# EasyEDA Pro project can-mcu.eprj, schematic mod-input-isolated
Board Name: mod-input-isolated; Create Date: 2026-08-19; Page Name: P1; Project Name: can-mcu; Schematic Name: mod-input-isolated; Update Date: 2026-08-19; Company: EasyEDA.com; Page Size: A4; Version: V1.0
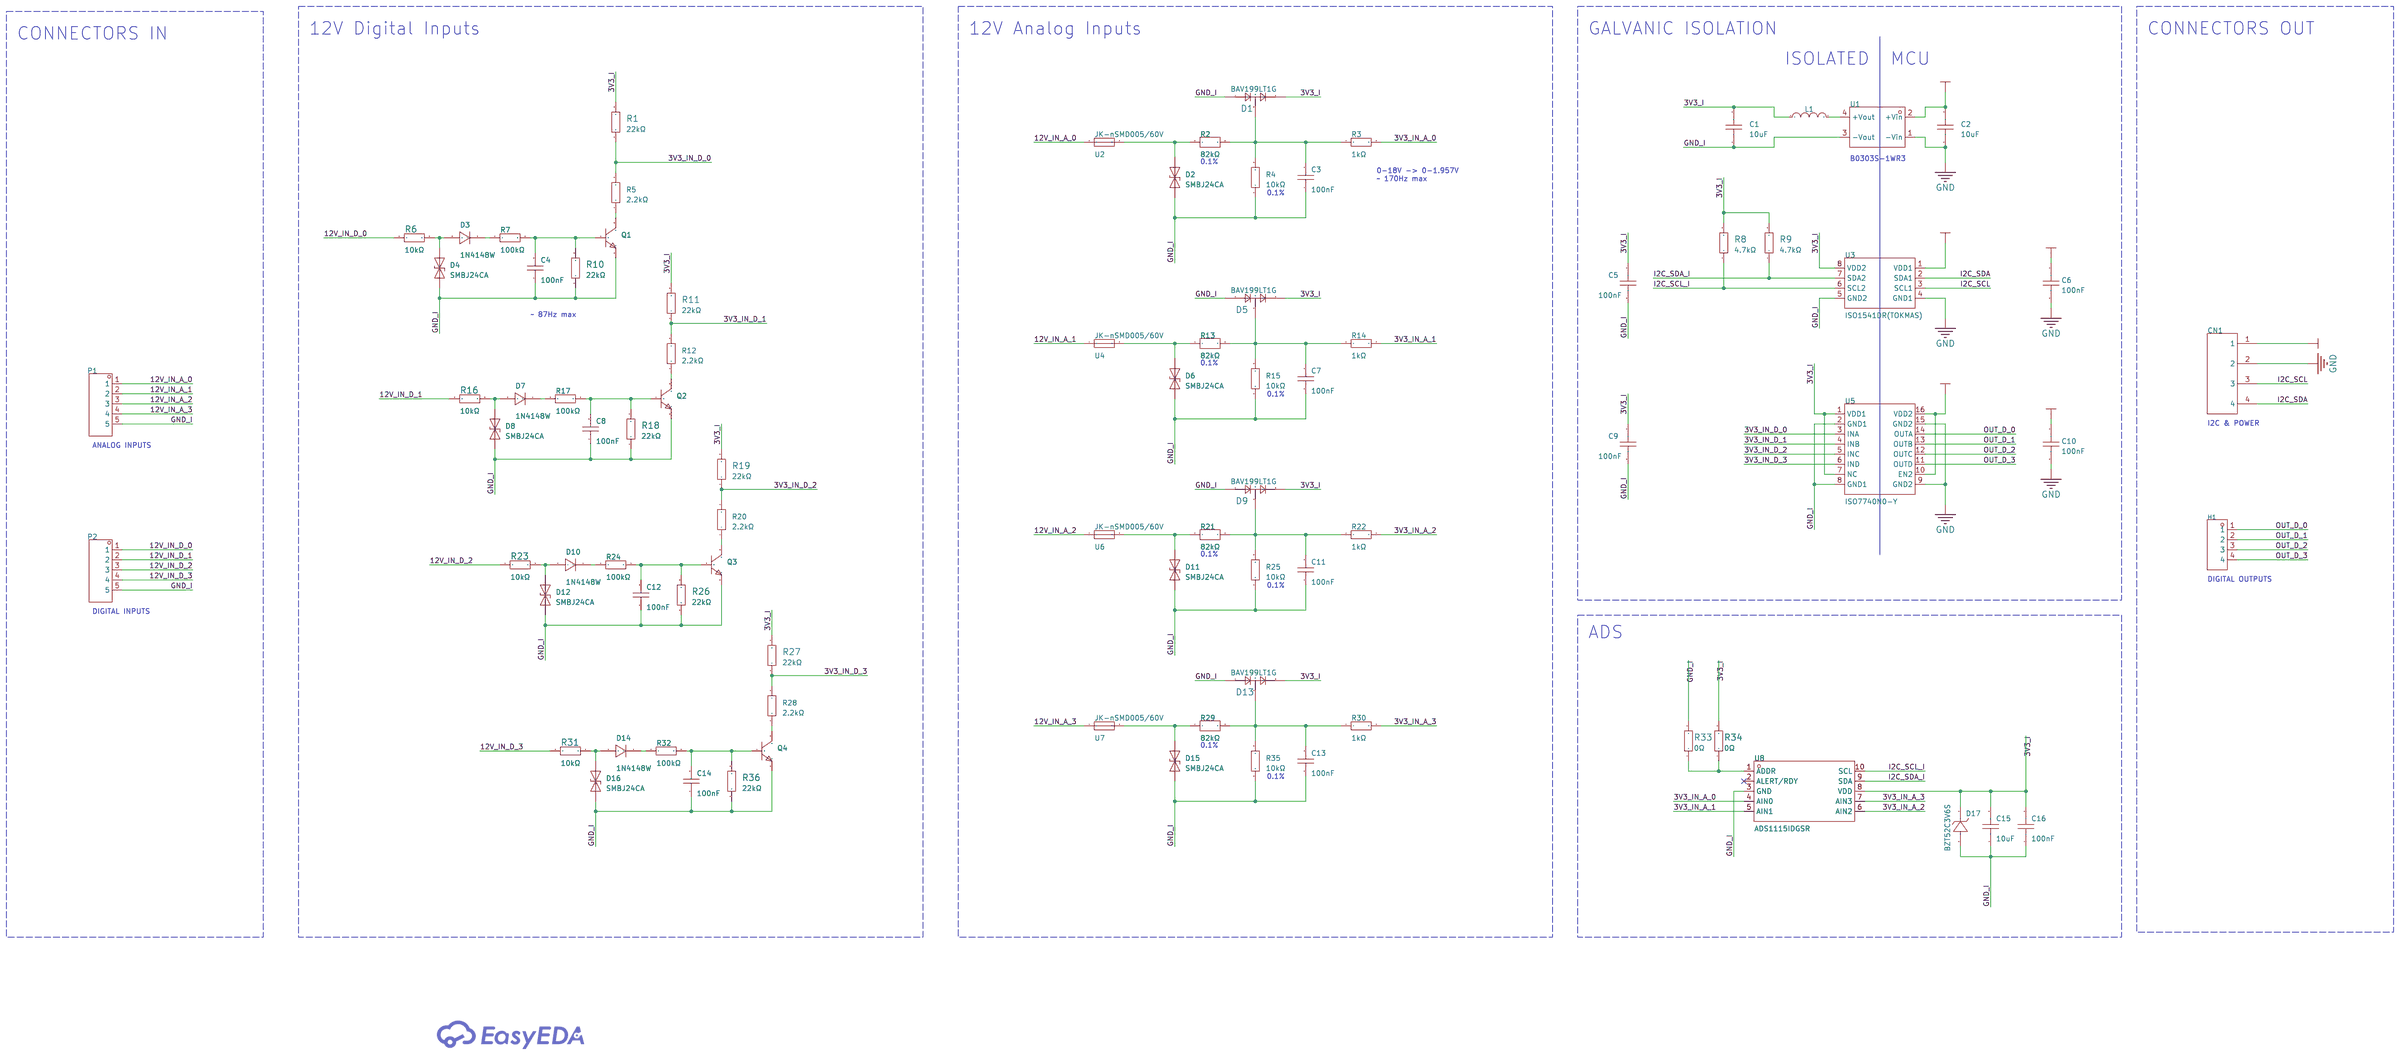
[diagram p5: schematic sheet]

## Parts
C1  10uF  [C0805]
C2  10uF  [C0805]
C3  100nF  [C0805]
C4  100nF  [C0805]
C5  100nF  [C0603]
C6  100nF  [C0603]
C7  100nF  [C0805]
C8  100nF  [C0805]
C9  100nF  [C0603]
C10  100nF  [C0603]
C11  100nF  [C0805]
C12  100nF  [C0805]
C13  100nF  [C0805]
C14  100nF  [C0805]
C15  10uF  [C0603]
C16  100nF  [C0402]
CN1  B4B-PH-K-S(LF)(SN)  [CONN-TH_B4B-PH-K-S]
D1  BAV199LT1G  [SOT-23_L2.9-W1.3-P1.90-LS2.4-BR]
D2  SMBJ24CA  [SMB_L4.6-W3.6-LS5.3-BI]
D3  1N4148W  [SOD-123_L2.8-W1.8-LS3.7-RD]
D4  SMBJ24CA  [SMB_L4.6-W3.6-LS5.3-BI]
D5  BAV199LT1G  [SOT-23_L2.9-W1.3-P1.90-LS2.4-BR]
D6  SMBJ24CA  [SMB_L4.6-W3.6-LS5.3-BI]
D7  1N4148W  [SOD-123_L2.8-W1.8-LS3.7-RD]
D8  SMBJ24CA  [SMB_L4.6-W3.6-LS5.3-BI]
D9  BAV199LT1G  [SOT-23_L2.9-W1.3-P1.90-LS2.4-BR]
D10  1N4148W  [SOD-123_L2.8-W1.8-LS3.7-RD]
D11  SMBJ24CA  [SMB_L4.6-W3.6-LS5.3-BI]
D12  SMBJ24CA  [SMB_L4.6-W3.6-LS5.3-BI]
D13  BAV199LT1G  [SOT-23_L2.9-W1.3-P1.90-LS2.4-BR]
D14  1N4148W  [SOD-123_L2.8-W1.8-LS3.7-RD]
D15  SMBJ24CA  [SMB_L4.6-W3.6-LS5.3-BI]
D16  SMBJ24CA  [SMB_L4.6-W3.6-LS5.3-BI]
D17  BZT52C3V6S  [SOD-323_L1.7-W1.3-LS2.6-RD]
H1  PZ254V-11-04P  [HDR-TH_4P-P2.54-V-M]
L1  BLM18PG121SN1D  [L0603]
P1  WJ15EDGRC-3.81-5P  [CONN-TH_5P-P3.81_WJ15EDGRC-3.81-5P]
P2  WJ15EDGRC-3.81-5P  [CONN-TH_5P-P3.81_WJ15EDGRC-3.81-5P]
Q1  MMBT3904(RANGE:100-300)  [SOT-23-3_L2.9-W1.3-P1.90-LS2.4-BR]
Q2  MMBT3904(RANGE:100-300)  [SOT-23-3_L2.9-W1.3-P1.90-LS2.4-BR]
Q3  MMBT3904(RANGE:100-300)  [SOT-23-3_L2.9-W1.3-P1.90-LS2.4-BR]
Q4  MMBT3904(RANGE:100-300)  [SOT-23-3_L2.9-W1.3-P1.90-LS2.4-BR]
R1  22kΩ  [R0603]
R2  82kΩ  [R1206]
R3  1kΩ  [R0603]
R4  10kΩ  [R1206]
R5  2.2kΩ  [R0603]
R6  10kΩ  [R1206]
R7  100kΩ  [R0603]
R8  4.7kΩ  [R0402]
R9  4.7kΩ  [R0402]
R10  22kΩ  [R0603]
R11  22kΩ  [R0603]
R12  2.2kΩ  [R0603]
R13  82kΩ  [R1206]
R14  1kΩ  [R0603]
R15  10kΩ  [R1206]
R16  10kΩ  [R1206]
R17  100kΩ  [R0603]
R18  22kΩ  [R0603]
R19  22kΩ  [R0603]
R20  2.2kΩ  [R0603]
R21  82kΩ  [R1206]
R22  1kΩ  [R0603]
R23  10kΩ  [R1206]
R24  100kΩ  [R0603]
R25  10kΩ  [R1206]
R26  22kΩ  [R0603]
R27  22kΩ  [R0603]
R28  2.2kΩ  [R0603]
R29  82kΩ  [R1206]
R30  1kΩ  [R0603]
R31  10kΩ  [R1206]
R32  100kΩ  [R0603]
R33  0Ω  [R1206]
R34  0Ω  [R1206]  (no BOM)
R35  10kΩ  [R1206]
R36  22kΩ  [R0603]
U1  200kHz~340kHz  [PWRM-TH_BXXXXS-1WR3]
U2  JK-nSMD005/60V  [F1206]
U3  ISO1541DR(TOKMAS)  [SOIC-8_L4.9-W4.0-P1.27-LS6.0-BL]
U4  JK-nSMD005/60V  [F1206]
U5  ISO7740N0-Y  [SOIC-16_L9.9-W3.9-P1.27-LS6.0-BL-1]
U6  JK-nSMD005/60V  [F1206]
U7  JK-nSMD005/60V  [F1206]
U8  ADS1115IDGSR  [MSOP-10_L3.0-W3.0-P0.50-LS5.0-BL]

## Library data of the parts
C1 C2 = CL21A106KAYNNNE_C15850: Capacitance:10uF Tolerance:±10% Tolerance:±10% Voltage Rating:25V Temperature Coefficient:X5R; LCSC Part Name: 10uF ±10% 25V; Supplier Part: C15850; Manufacturer: SAMSUNG(三星); Manufacturer Part: CL21A106KAYNNNE; Supplier Footprint: 0805; JLCPCB Part Class: Basic Part; Datasheet: https://item.szlcsc.com/datasheet/CL21A106KAYNNNE/16532.html; Supplier: LCSC; Tolerance: ±10%; Voltage Rating: 25V; Temperature Coefficient: X5R
C3 C4 C7 C8 C11-C14 = CL21B104KCFNNNE: LCSC Part Name: 100nF ±10% 100V; Supplier Part: C28233; Manufacturer: SAMSUNG(三星); Supplier Footprint: 0805; Datasheet: https://item.szlcsc.com/datasheet/CL21B104KCFNNNE/28983.html; Supplier: LCSC; Tolerance: ±10%; Voltage Rating: 100V; Temperature Coefficient: X7R
C5 C6 C9 C10 = CC0603KRX7R9BB104: Capacitance:100nF Tolerance:±10% Tolerance:±10% Voltage Rating:50V Temperature Coefficient:X7R; LCSC Part Name: 100nF ±10% 50V; Supplier Part: C14663; Manufacturer: YAGEO(国巨); Supplier Footprint: 0603; JLCPCB Part Class: Basic Part; Datasheet: https://item.szlcsc.com/datasheet/CC0603KRX7R9BB104/15331.html; Supplier: LCSC; Tolerance: ±10%; Voltage Rating: 50V; Temperature Coefficient: X7R
C15 = CL10A106KP8NNNC: LCSC Part Name: 10uF ±10% 10V; Supplier Part: C19702; Manufacturer: SAMSUNG(三星); Supplier Footprint: 0603; Datasheet: https://item.szlcsc.com/datasheet/CL10A106KP8NNNC/20411.html; Supplier: LCSC; Tolerance: ±10%; Voltage Rating: 10V; Temperature Coefficient: X5R
C16 = CL05B104KO5NNNC: LCSC Part Name: 100nF ±10% 16V; Supplier Part: C1525; Manufacturer: SAMSUNG(三星); Supplier Footprint: 0402; Datasheet: https://item.szlcsc.com/datasheet/CL05B104KO5NNNC/1877.html; Supplier: LCSC; Tolerance: ±10%; Voltage Rating: 16V; Temperature Coefficient: X7R
CN1 = B4B-PH-K-S(LF)(SN)_C131334: LCSC Part Name: 1x4P 间距:2mm 直插 系列:PH; Supplier Part: C131334; Manufacturer: JST; Supplier Footprint: 插件,P=2mm; JLCPCB Part Class: Extended Part; Datasheet: https://item.szlcsc.com/datasheet/B4B-PH-K-S(LF)(SN)/142627.html; Supplier: LCSC; Pins Structure: 1x4P; Pitch: 2mm; Mounting Type: Through Hole; Reference Series: PH; Number of Pins: 4P; Number of Rows: 1; Number of PINs Per Row: 4; Current Rating: 2A; Contact Material: Brass; Contact Plating: Tin; Operating Temperature: -25℃~+85℃; Voltage Rating: 100V; Plastic Material: PA66; Flame Retardant Rating: UL94V-0; Supplementary Features: K Pin; Color: White; Z-Height of the Board: 6mm; X-Length of Bottom Edge on Board (Spacing Line): 9.9mm; Y-Width of Bottom Edge on Board: 4.5mm
D1 D5 D9 D13 = BAV199LT1G: LCSC Part Name: 70V 215mA; Supplier Part: C145516; Manufacturer: onsemi(安森美); Supplier Footprint: SOT-23; JLCPCB Part Class: Extended Part; Datasheet: https://item.szlcsc.com/datasheet/BAV199LT1G/156848.html; Supplier: LCSC; Diode Configuration: 1 Pair Series Connection; Voltage - Forward(Vf@If): 1.25V@150mA; Voltage - DC Reverse(Vr): 70V; Current - Rectified: 215mA; Reverse Leakage Current (Ir): 5uA@70V; Non-Repetitive Peak Forward Surge Current: 2A; Operating Junction Temperature Range: -65℃~+150℃
D2 D4 D6 D8 D11 D12 D15 D16 = SMBJ24CA_C78416: LCSC Part Name: 24V截止 15.5A峰值脉冲; Supplier Part: C78416; Manufacturer: Brightking(君耀电子); Supplier Footprint: SMB(DO-214AA); Datasheet: https://atta.szlcsc.com/upload/public/pdf/source/20181127/C309995_EB3DFB9F9AEE5D2146ECD9FA5992A402.pdf; Supplier: LCSC; Reverse Stand-Off Voltage (Vrwm): 24V; Maximum Clamping Voltage: 38.9V; Peak Pulse Current (Ipp): 15.5A; Breakdown Voltage: 26.7V; Type: TVS
D3 D7 D10 D14 = 1N4148W_C2099: LCSC Part Name: 丝印T4 100V 150mA; Supplier Part: C2099; Manufacturer: CJ(江苏长电/长晶); Supplier Footprint: SOD-123; JLCPCB Part Class: Extended Part; Datasheet: https://item.szlcsc.com/datasheet/1N4148W/2456.html; Supplier: LCSC; Diode Configuration: Standalone; Pd - Power Dissipation: 500mW; Current - Rectified: 150mA; Voltage - DC Reverse(Vr): 100V; Voltage - Forward(Vf@If): 1.25V@150mA; Non-Repetitive Peak Forward Surge Current: 2A; Reverse Leakage Current (Ir): 1uA@75V; Reverse Recovery Time (trr): 4ns
D17 = BZT52C3V6S_C19077438: LCSC Part Name: 表面贴装齐纳二极管; Supplier Part: C19077438; Manufacturer: R+O(宏嘉诚); Supplier Footprint: SOD-323; JLCPCB Part Class: Extended Part; Datasheet: https://item.szlcsc.com/datasheet/BZT52C3V6S/20275523.html; Supplier: LCSC; Diode Configuration: 1 Independent; Zener Voltage(Nom): 3.6V; Reverse Leakage Current (Ir): 5uA; Zener Voltage(Range): 3.4V~3.8V; Pd - Power Dissipation: 200mW; Impedance(Zzt): 90Ω; Impedance(Zzk): 600Ω; Operating Junction Temperature Range: -55℃~+150℃
H1 = PZ254V-11-04P: LCSC Part Name: 1x4P 间距:2.54mm 方针 直插; Supplier Part: C2691448; Manufacturer: XFCN(兴飞); Supplier Footprint: 插件,P=2.54mm; JLCPCB Part Class: Extended Part; Datasheet: https://item.szlcsc.com/datasheet/PZ254V-11-04P/2801085.html; Supplier: LCSC; Pin Structure: 1x4P; Pitch: 2.54mm; Circluar Pins/Square Pins: Pin Header; Mounting Type: Through Hole; Number of Rows: 1; Number of Pins: 4P; Current Rating: 3A; Voltage Rating (Max): 250V; Length of Mating Pin: 6mm; Insulation Height: 2.5mm; Length of End Connection Pin: 3mm; Operating Temperature: -40℃~+105℃; Color: Black
L1 = BLM18PG121SN1D_C14709: LCSC Part Name: 单路 0603磁珠 阻抗120Ω@100MHz; Supplier Part: C14709; Manufacturer: muRata(村田); Supplier Footprint: 0603; Datasheet: https://item.szlcsc.com/datasheet/BLM18PG121SN1D/15379.html; Supplier: LCSC; Impedance @ Frequency: 120Ω@100MHz; Tolerance: ±25%; DC Resistance(DCR): 50mΩ; Current Rating: 2A; Number of Circuits: 1; Operating Temperature: -55℃~+125℃
P1 P2 = WJ15EDGRC-3.81-5P: Connector Type:Board Side/Socket - Closed Termination Style:- Number of Positions or Pins:1x5P Pitch:3.81mm Color:- Mounting Type:Right-Angle Pin Number of Pins:5P Number of Rows:1 Number of PINs Per Row:5 Current Rating:- Voltage Rating (Max):- Wire Gaug; LCSC Part Name: 1x5P 3.81mm 排数:1 每排P数:5; Supplier Part: C8395; Manufacturer: KANGNEX(康奈克斯电气); Supplier Footprint: 弯插,P=3.81mm; JLCPCB Part Class: Extended Part; Datasheet: https://item.szlcsc.com/datasheet/WJ15EDGRC-3.81-5P/8889.html; Supplier: LCSC; Connector Type: Board Side/Socket - Closed; Number of Positions or Pins: 1x5P; Pitch: 3.81mm; Mounting Type: Right-Angle Pin; Number of Pins: 5P; Number of Rows: 1; Number of PINs Per Row: 5; Operating Temperature: -40℃~+105℃
Q1-Q4 = MMBT3904(RANGE:100-300): LCSC Part Name: hfe=100~300 NPN 电流:200mA 电压:40V; Supplier Part: C20526; Manufacturer: CJ(江苏长电/长晶); Supplier Footprint: SOT-23; JLCPCB Part Class: Basic Part; Datasheet: https://item.szlcsc.com/datasheet/MMBT3904(RANGE%253A100-300)/21237.html; Supplier: LCSC; type: NPN; Current - Collector(Ic): 200mA; Collector - Emitter Voltage VCEO: 40V; Pd - Power Dissipation: 200mW; DC Current Gain: 100@10mA,1V; Transition frequency(fT): 300MHz; Current - Collector Cutoff: 100nA; Vce Saturation(VCE(sat)): 300mV@50mA,5mA; Operating Temperature: -55℃~+150℃; Emitter-Base Voltage(Vebo): 6V; Number: 1 NPN
R1 R10 R11 R18 R19 R26 R27 R36 = 0603WAF2202T5E: LCSC Part Name: 22kΩ ±1% 100mW 厚膜电阻; Supplier Part: C31850; Manufacturer: UNI-ROYAL(厚声); Supplier Footprint: 0603; JLCPCB Part Class: Basic Part; Datasheet: https://item.szlcsc.com/datasheet/0603WAF2202T5E/32812.html; Supplier: LCSC; Type: Thick Film Resistor; Tolerance: ±1%; Power(Watts): 100mW; Voltage-Supply(Max): 75V; Temperature Coefficient: ±100ppm/℃; Operating Temperature: -55℃~+155℃
R2 R13 R21 R29 = RT1206BRD0782KL: LCSC Part Name: 薄膜电阻 82kΩ ±0.1% 250mW; Supplier Part: C870906; Manufacturer: YAGEO(国巨); Supplier Footprint: 1206; Datasheet: https://item.szlcsc.com/datasheet/RT1206BRD0782KL/931001.html; Supplier: LCSC; Type: Thin Film Resistor; Tolerance: ±0.1%; Power(Watts): 250mW; Voltage-Supply(Max): 200V; Temperature Coefficient: ±25ppm/℃; Operating Temperature: -55℃~+155℃
R3 R14 R22 R30 = 0603WAF1001T5E: Type:Thick Film Resistors Resistance:1kΩ Tolerance:±1% Tolerance:±1% Power(Watts): Overload Voltage (Max): Temperature Coefficient:±100ppm/℃ Temperature Coefficient:±100ppm/℃ Operating Temperature Range:-55℃~+155℃ Operating Temperature Range:-55℃~+155℃; LCSC Part Name: 1kΩ ±1% 100mW 厚膜电阻; Supplier Part: C21190; Manufacturer: UNI-ROYAL(厚声); Supplier Footprint: 0603; JLCPCB Part Class: Basic Part; Datasheet: https://atta.szlcsc.com/upload/public/pdf/source/20200306/C422600_1E6D84923E4A46A82E41ADD87F860B5C.pdf; Supplier: LCSC; Type: Thick Film Resistors; Tolerance: ±1%; Temperature Coefficient: ±100ppm/℃; Operating Temperature Range: -55℃~+155℃
R4 R15 R25 R35 = RT1206BRD0710KL: LCSC Part Name: 薄膜电阻 10kΩ ±0.1% 250mW; Supplier Part: C136889; Manufacturer: YAGEO(国巨); Supplier Footprint: 1206; JLCPCB Part Class: Extended Part; Datasheet: https://item.szlcsc.com/datasheet/RT1206BRD0710KL/148205.html; Supplier: LCSC; Type: Thin Film Resistor; Tolerance: ±0.1%; Power(Watts): 250mW; Voltage-Supply(Max): 200V; Temperature Coefficient: ±25ppm/℃; Operating Temperature: -55℃~+155℃
R5 R12 R20 R28 = 0603WAF2201T5E_C4190: Type:Thick Film Resistors Resistance:2.2kΩ Tolerance:±1% Tolerance:±1% Power(Watts): Overload Voltage (Max): Temperature Coefficient:±100ppm/℃ Temperature Coefficient:±100ppm/℃ Operating Temperature Range:-55℃~+155℃ Operating Temperature Range:-55℃~+155℃; LCSC Part Name: 2.2kΩ ±1% 100mW 厚膜电阻; Supplier Part: C4190; Manufacturer: UNI-ROYAL(厚声); Manufacturer Part: 0603WAF2201T5E; Supplier Footprint: 0603; JLCPCB Part Class: Basic Part; Datasheet: https://atta.szlcsc.com/upload/public/pdf/source/20200306/C422600_1E6D84923E4A46A82E41ADD87F860B5C.pdf; Supplier: LCSC; Type: Thick Film Resistors; Tolerance: ±1%; Temperature Coefficient: ±100ppm/℃; Operating Temperature Range: -55℃~+155℃
R6 R16 R23 R31 = 1206W4F1002T5E: LCSC Part Name: 10kΩ ±1% 250mW 厚膜电阻; Supplier Part: C17902; Manufacturer: UNI-ROYAL(厚声); Supplier Footprint: 1206; JLCPCB Part Class: Basic Part; Datasheet: https://item.szlcsc.com/datasheet/1206W4F1002T5E/18590.html; Supplier: LCSC; Type: Thick Film Resistor; Tolerance: ±1%; Power(Watts): 250mW; Voltage-Supply(Max): 200V; Temperature Coefficient: ±100ppm/℃; Operating Temperature: -55℃~+155℃
R7 R17 R24 R32 = 0603WAF1003T5E: Type:Thick Film Resistor Resistance:100kΩ Tolerance:±1% Tolerance:±1% Power(Watts):100mW Voltage-Supply(Max):75V Temperature Coefficient:±100ppm/℃ Temperature Coefficient:±100ppm/℃ Operating Temperature:-55℃~+155℃ Operating Temperature:-55℃~+155℃; LCSC Part Name: 100kΩ ±1% 100mW 厚膜电阻; Supplier Part: C25803; Manufacturer: UNI-ROYAL(厚声); Supplier Footprint: 0603; JLCPCB Part Class: Basic Part; Datasheet: https://item.szlcsc.com/datasheet/0603WAF1003T5E/26546.html; Supplier: LCSC; Type: Thick Film Resistor; Tolerance: ±1%; Power(Watts): 100mW; Voltage-Supply(Max): 75V; Temperature Coefficient: ±100ppm/℃; Operating Temperature: -55℃~+155℃
R8 R9 = 0402WGF4701TCE: LCSC Part Name: 4.7kΩ ±1% 62.5mW 厚膜电阻; Supplier Part: C25900; Manufacturer: UNI-ROYAL(厚声); Supplier Footprint: 0402; Datasheet: https://item.szlcsc.com/datasheet/0402WGF4701TCE/26643.html; Supplier: LCSC; Type: Thick Film Resistor; Tolerance: ±1%; Power(Watts): 62.5mW; Voltage-Supply(Max): 50V; Temperature Coefficient: ±100ppm/℃; Operating Temperature: -55℃~+155℃
R33 R34 = 1206W4F0000T5E: LCSC Part Name: 0Ω ±1% 250mW 厚膜电阻; Supplier Part: C17888; Manufacturer: UNI-ROYAL(厚声); Supplier Footprint: 1206; JLCPCB Part Class: Basic Part; Datasheet: https://item.szlcsc.com/datasheet/1206W4F0000T5E/18576.html; Supplier: LCSC; Type: Thick Film Resistor; Tolerance: ±1%; Power(Watts): 250mW; Voltage-Supply(Max): 200V; Temperature Coefficient: ±800ppm/℃; Operating Temperature: -55℃~+155℃
U1 = B0303S-1WR3_C7465185: Type:Plastic encapsulated type Number of Outputs:1 Output Power:1W Voltage - Supply:2.97V~3.63V Voltage - Supply:2.97V~3.63V Conversion Efficiency:72% Conversion Efficiency:72% Output Voltage:3.3V Output Voltage:3.3V Output Current(Max):303mA Output Curre; LCSC Part Name: 2.97V~3.63V 3.3V 303mA 1W; Supplier Part: C7465185; Manufacturer: EVISUN(易成); Manufacturer Part: B0303S-1WR3; Supplier Footprint: SIP,11.7x6mm; JLCPCB Part Class: Extended Part; Datasheet: https://item.szlcsc.com/datasheet/B0303S-1WR3/8505852.html; Supplier: LCSC; Type: Plastic encapsulated type; Number of Outputs: 1; Output Power: 1W; Voltage - Supply: 2.97V~3.63V; Conversion Efficiency: 72%; Output Voltage: 3.3V; Output Current(Max): 303mA; Capacitive Load(Max): 2400uF; Isolation Voltage(Vrms): 1.5kV; Features: Short Circuit Protection; Operating Temperature: -40℃~+105℃; Ripple Noise: 30mVp-p; Length: 11.68mm; Width: 10.2mm; Height: 6mm; Voltage Regulation: Non-regulated type
U2 U4 U6 U7 = JK-nSMD005/60V: LCSC Part Name: 60V 0.05A 1206自恢复; Supplier Part: C2830235; Manufacturer: JK(金科); Supplier Footprint: 1206; JLCPCB Part Class: Extended Part; Datasheet: https://item.szlcsc.com/datasheet/JK-nSMD005%252F60V/2981864.html; Supplier: LCSC; Voltage - Max: 60V; Current - Max: 100A; Hold Current: 50mA; Trip Current: 150mA; Resistance - Initial (Ri) (Min): 3.6Ω; Resistance - Post Trip (R1) (Max): 50Ω; Time to Trip(Max): 1.5s; Operating Temperature: -40℃~+85℃; Length: 3.5mm; Width: 1.8mm; Height: 1.1mm
U3 = ISO1541DR(TOKMAS): Clock Direction:Bidirectional Isolation Voltage(Vrms):3000 CMTI(kV/us):88kV/us Operating Temperature:-40℃~+125℃ Operating Temperature:-40℃~+125℃; Supplier Part: C7589224; Manufacturer: Tokmas(托克马斯); Supplier Footprint: SOIC-8; Datasheet: https://item.szlcsc.com/datasheet/ISO1541DR(TOKMAS)/8711757.html; Supplier: LCSC; Clock Direction: Bidirectional; Isolation Voltage(Vrms): 3000; CMTI(kV/us): 88kV/us; Operating Temperature: -40℃~+125℃
U5 = ISO7740N0-Y: LCSC Part Name: 四通道隔离器-窄体; Supplier Part: C53446590; Manufacturer: YLPTEC(易川); Supplier Footprint: SOIC-16; Datasheet: https://item.szlcsc.com/datasheet/ISO7740N0-Y/56597970.html; Supplier: LCSC; Number of Forward Channels: 4; Number of Reverse Channels: 0; Data Rate(Max): 150Mbps; Default Output: Low Level; CMTI(kV/us): 150kV/us; Propagation Delay(tpd): 9ns; Voltage - Supply(VCCA): 2.5V~5.5V; Voltage - Supply(VCCB): 2.5V~5.5V; Operating Temperature: -40℃~+125℃
U8 = ADS1115IDGSR: LCSC Part Name: 具有内部基准、振荡器和可编程比较器且兼容 I2C 的ADS111x、超小型、低功耗 860SPS、16位ADC; Supplier Part: C37593; Manufacturer: TI(德州仪器); Supplier Footprint: VSSOP-10; JLCPCB Part Class: Extended Part; Datasheet: https://www.ti.com/cn/lit/ds/symlink/ads1115.pdf; Supplier: LCSC; Resolution (Bits): 16; Sampling Rate: 860Hz; number of channels: 2; Voltage - Supply: 2V~5.5V; Interface: I2C; differential input: Yes; Integral non - linearity: 1LSB; Operating Temperature: -40℃~+125℃; Clock/Oscillator: Built-in; Voltage Reference: Built-in; Programmable Gain: Support; ADC architecture: Sigma-Delta; Quiescent Current (Iq): 500nA; Features: Integrated modulator；Multiplexers；Built-in digital filter；Power-on reset

## Nets
3V3_I: C1.2 C5.1 C9.1 C15.2 C16.2 D1.2(C) D5.2(C) D9.2(C) D13.2(C) D17.1(K) L1.1 R1.2 R8.2 R9.2 R11.2 R19.2 R27.2 R34.2 U3.8(VDD2) U5.1(VDD1) U5.7(NC) U8.8(VDD)
3V3_IN_A_0: R3.2 U8.4(AIN0)
3V3_IN_A_1: R14.2 U8.5(AIN1)
3V3_IN_A_2: R22.2 U8.6(AIN2)
3V3_IN_A_3: R30.2 U8.7(AIN3)
3V3_IN_D_0: R1.1 R5.2 U5.3(INA)
3V3_IN_D_1: R11.1 R12.2 U5.4(INB)
3V3_IN_D_2: R19.1 R20.2 U5.5(INC)
3V3_IN_D_3: R27.1 R28.2 U5.6(IND)
12V_IN_A_0: P1.1 U2.1
12V_IN_A_1: P1.2 U4.1
12V_IN_A_2: P1.3 U6.1
12V_IN_A_3: P1.4 U7.1
12V_IN_D_0: P2.1 R6.1
12V_IN_D_1: P2.2 R16.1
12V_IN_D_2: P2.3 R23.1
12V_IN_D_3: P2.4 R31.1
+3V3: C2.2 C6.1 C10.1 CN1.1 U1.2(+Vin) U3.1(VDD1) U5.10(EN2) U5.16(VDD2)
GND: C2.1 C6.2 C10.2 CN1.2 U1.1(-Vin) U3.4(GND1) U5.9(GND2) U5.15(GND2)
GND_I: C1.1 C3.1 C4.1 C5.2 C7.1 C8.1 C9.2 C11.1 C12.1 C13.1 C14.1 C15.1 C16.1 D1.1(A) D2.2(A) D4.2(A) D5.1(A) D6.2(A) D8.2(A) D9.1(A) D11.2(A) D12.2(A) D13.1(A) D15.2(A) D16.2(A) D17.2(A) P1.5 P2.5 Q1.2(E) Q2.2(E) Q3.2(E) Q4.2(E) R4.1 R10.1 R15.1 R18.1 R25.1 R26.1 R33.2 R35.1 R36.1 U1.3(-Vout) U3.5(GND2) U5.2(GND1) U5.8(GND1) U8.3(GND)
I2C_SCL: CN1.3 U3.3(SCL1)
I2C_SCL_I: R8.1 U3.6(SCL2) U8.10(SCL)
I2C_SDA: CN1.4 U3.2(SDA1)
I2C_SDA_I: R9.1 U3.7(SDA2) U8.9(SDA)
OUT_D_0: H1.1 U5.14(OUTA)
OUT_D_1: H1.2 U5.13(OUTB)
OUT_D_2: H1.3 U5.12(OUTC)
OUT_D_3: H1.4 U5.11(OUTD)
$3N1497: C3.2 D1.3(C/A) R2.2 R3.1 R4.2
$3N5418: D2.1(K) R2.1 U2.2
$3N6208: R33.1 R34.1 U8.1(ADDR)
$3N9212: L1.2 U1.4(+Vout)
$3N10551: C7.2 D5.3(C/A) R13.2 R14.1 R15.2
$3N10564: D6.1(K) R13.1 U4.2
$3N10837: C11.2 D9.3(C/A) R21.2 R22.1 R25.2
$3N10850: D11.1(K) R21.1 U6.2
$3N11123: C13.2 D13.3(C/A) R29.2 R30.1 R35.2
$3N11136: D15.1(K) R29.1 U7.2
$3N12697: D3.1(K) R7.1
$3N12699: C4.2 Q1.1(B) R7.2 R10.2
$3N12700: Q1.3(C) R5.1
$3N12704: D3.2(A) D4.1(K) R6.2
$3N12705: D7.1(K) R17.1
$3N12707: C8.2 Q2.1(B) R17.2 R18.2
$3N12708: Q2.3(C) R12.1
$3N12712: D7.2(A) D8.1(K) R16.2
$3N12713: D10.1(K) R24.1
$3N12715: C12.2 Q3.1(B) R24.2 R26.2
$3N12716: Q3.3(C) R20.1
$3N12720: D10.2(A) D12.1(K) R23.2
$3N12721: D14.1(K) R32.1
$3N12723: C14.2 Q4.1(B) R32.2 R36.2
$3N12724: Q4.3(C) R28.1
$3N12728: D14.2(A) D16.1(K) R31.2

Not connected (* = marked no-connect by the designer): U8 2(ALERT/RDY)*

## Notes on the sheet
- CONNECTORS IN
- 12V Digital Inputs
- 12V Analog Inputs
- GALVANIC ISOLATION
- CONNECTORS OUT
- ISOLATED
- MCU
- 0.1%
- B0303S-1WR3
- 0-18V -> 0-1.957V
  ~ 170Hz max
- 0.1%
- ~ 87Hz max
- 0.1%
- 0.1%
- I2C & POWER
- ANALOG INPUTS
- 0.1%
- 0.1%
- DIGITAL OUTPUTS
- DIGITAL INPUTS
- ADS
- 0.1%
- 0.1%
